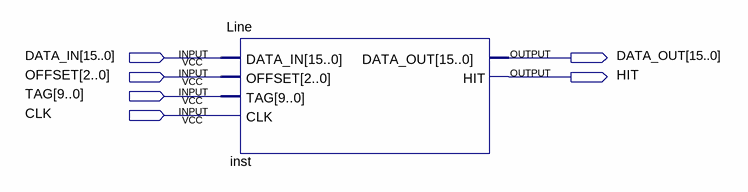
[diagram p0: schematic sheet]
// Quartus schematic TestLineSchema.bdf as structural Verilog: 1 symbols, 6 pins
module TestLineSchema (
  input  [15:0] DATA_IN,
  input  [2:0] OFFSET,
  input  [9:0] TAG,
  input  CLK,
  output [15:0] DATA_OUT,
  output HIT
);

  Line inst (.DATA_IN(DATA_IN), .OFFSET(OFFSET), .TAG(TAG), .CLK(CLK), .DATA_OUT(DATA_OUT), .HIT(HIT));
endmodule
